# Altium project Cleanroom PSM.PrjPcb
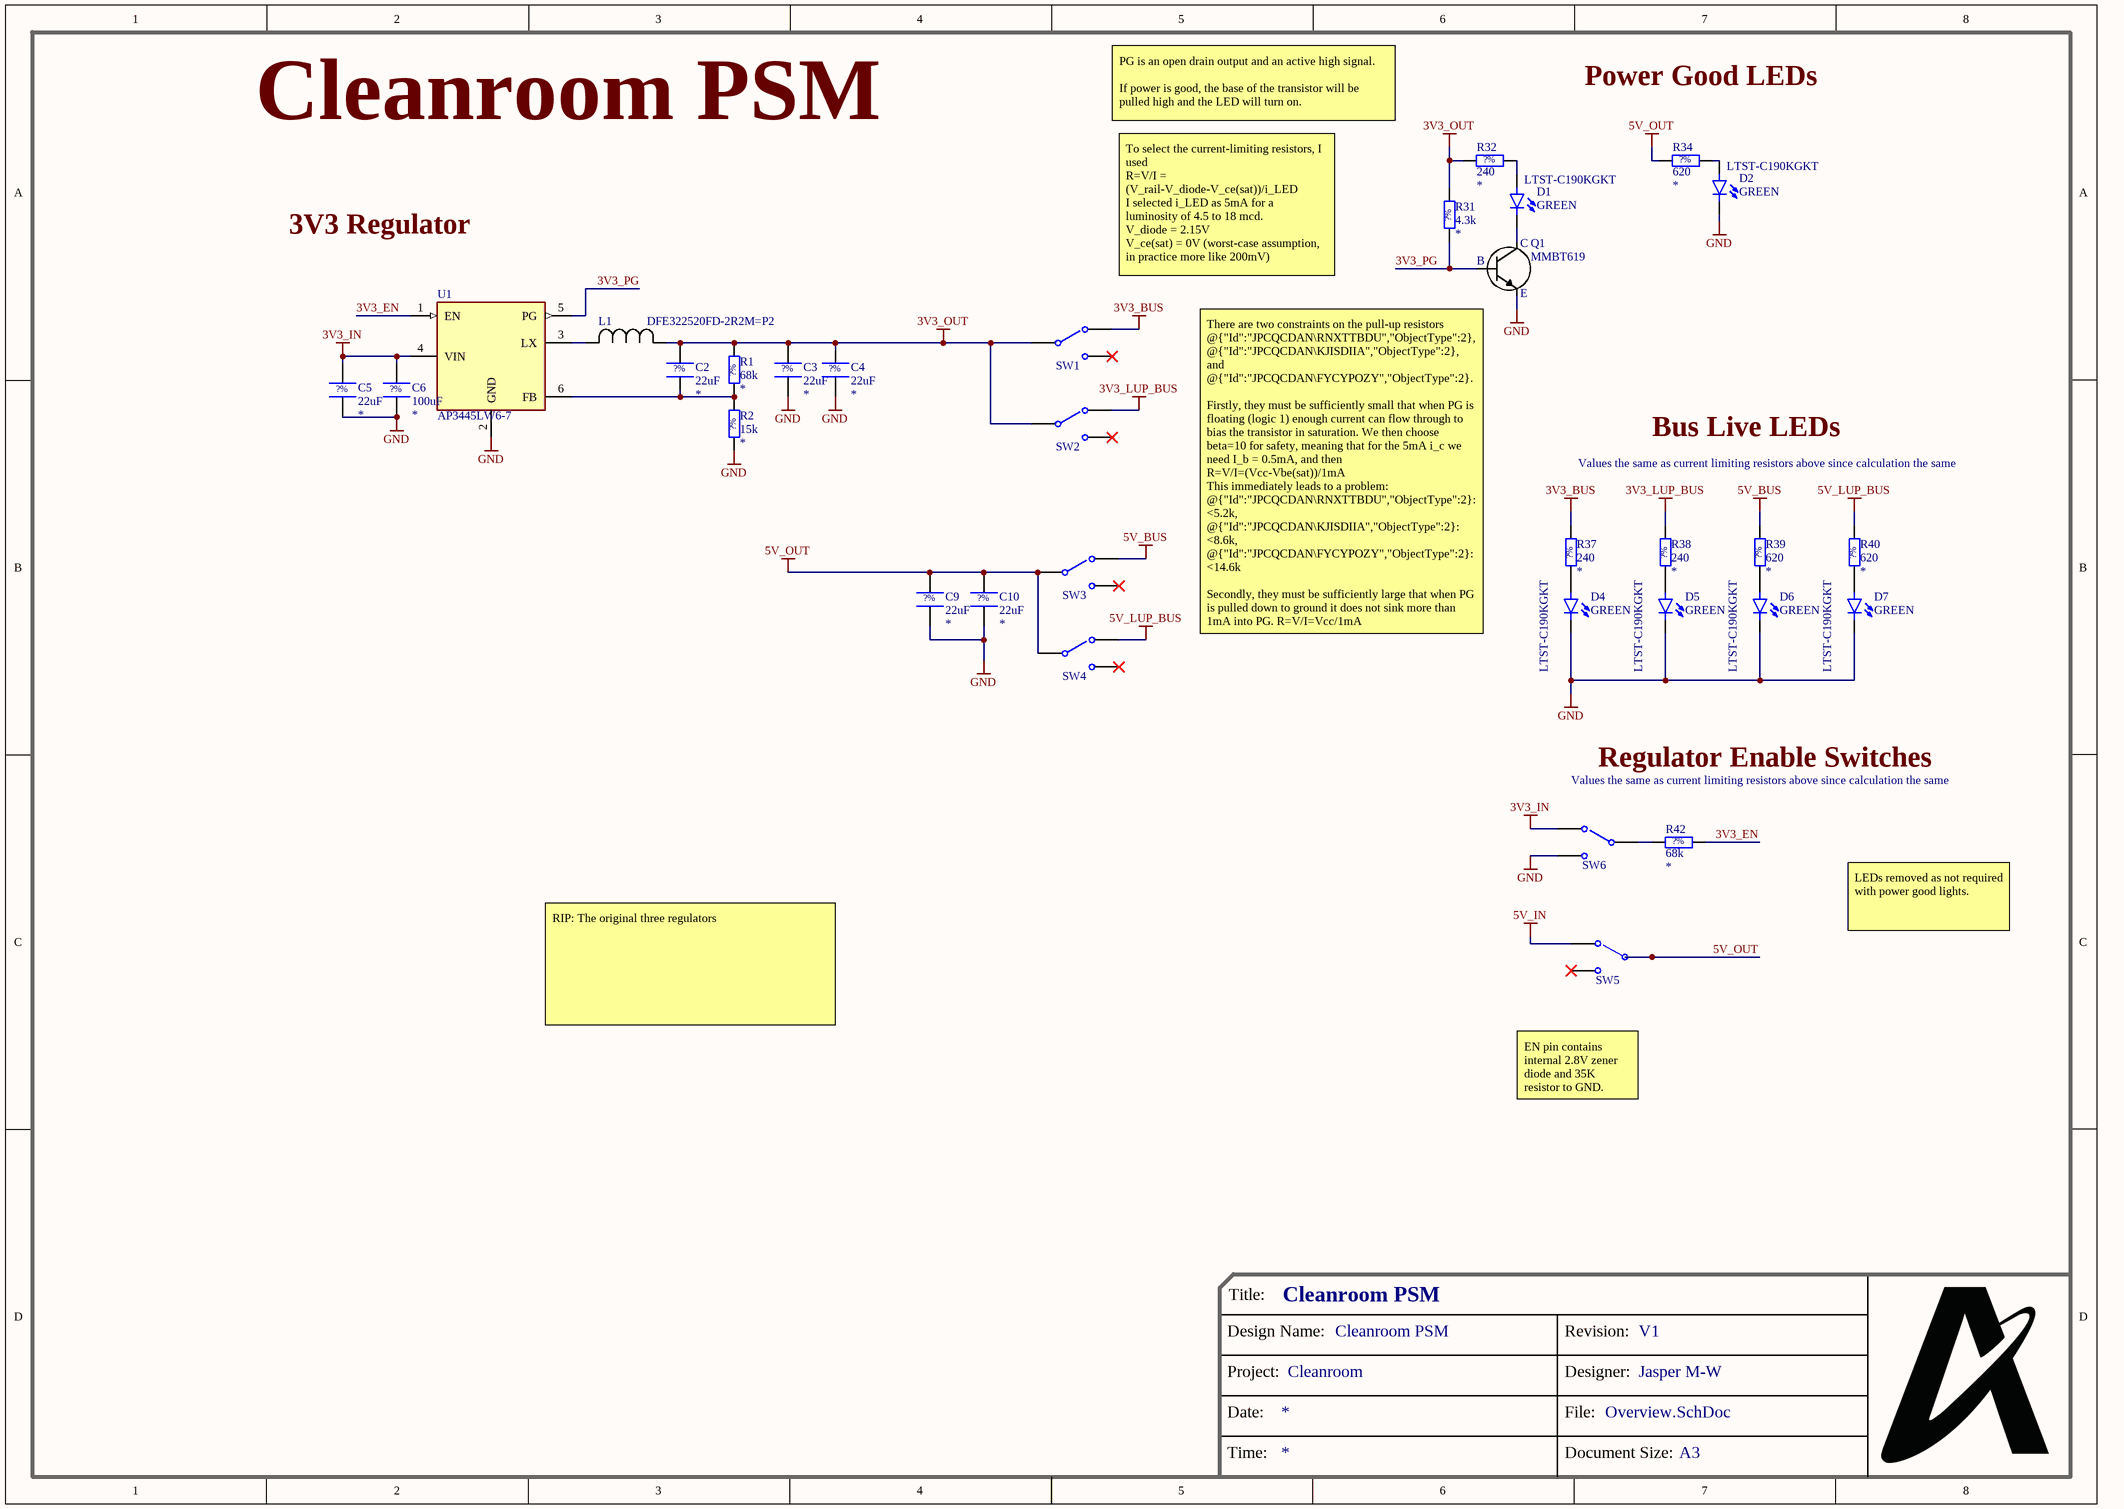
[diagram p0: Overview.SchDoc]
BoardRevision: V1; Designer: Jasper M-W; DesignName: Cleanroom PSM; Project: Cleanroom
2 sheets, 63 parts. Net scope: global (net labels, ports and power ports of the same name join across sheets).
Board file: Overview.PcbDoc
Sheets:
  Overview.SchDoc
  Interfaces.SchDoc

## Sheet Overview.SchDoc: Cleanroom PSM
size A3; PageSetup: Record=PageOptions|CenterHorizontal=True|CenterVertical=True|PrintScale=0.97|XCorrection=1.00|YCorrection=1.00|PrintKind=0|BorderSize=5000000|LeftOffset=0|BottomOffset=0|Orientation=2|PaperLength=1000|PaperWidth=1000|Scale=100|PaperSource=7|PrintQuality=-4|MediaType=1|DitherType=10|PaperKind=A4|PrintScaleMode=1; Revision: 1.1.0; SheetNumber: 1; SheetTotal: 2

### Parts
C2  22uF  [CAPACITOR_0805_2012M-70N]
C3  22uF  [CAPACITOR_0805_2012M-70N]
C4  22uF  [CAPACITOR_0805_2012M-70N]
C5  22uF  [CAPACITOR_0805_2012M-70N]
C6  100uF  [CAPACITOR_0805_2012M-70N]
C9  22uF  [CAPACITOR_0805_2012M-70N]
C10  22uF  [CAPACITOR_0805_2012M-70N]
D1  MF Part No.: LTST-C190KGKT  Colour: GREEN  [LED_0603_1608M_0.80mm]  (hidden comment: LTST-C190 Series)
D2  MF Part No.: LTST-C190KGKT  Colour: GREEN  [LED_0603_1608M_0.80mm]  (hidden comment: LTST-C190 Series)
D4  MF Part No.: LTST-C190KGKT  Colour: GREEN  [LED_0603_1608M_0.80mm]  (hidden comment: LTST-C190 Series)
D5  MF Part No.: LTST-C190KGKT  Colour: GREEN  [LED_0603_1608M_0.80mm]  (hidden comment: LTST-C190 Series)
D6  MF Part No.: LTST-C190KGKT  Colour: GREEN  [LED_0603_1608M_0.80mm]  (hidden comment: LTST-C190 Series)
D7  MF Part No.: LTST-C190KGKT  Colour: GREEN  [LED_0603_1608M_0.80mm]  (hidden comment: LTST-C190 Series)
L1  DFE322520FD-2R2M=P2  [IND_DFE3225_MUR]
Q1  MMBT619  [SOT23-3N-1.15mm]
R1  68k  [RESISTOR_0805_2012M-50N]
R2  15k  [RESISTOR_0805_2012M-50N]
R31  4.3k  [RESISTOR_0805_2012M-50N]
R32  240  [RESISTOR_0805_2012M-50N]
R34  620  [RESISTOR_0805_2012M-50N]
R37  240  [RESISTOR_0805_2012M-50N]
R38  240  [RESISTOR_0805_2012M-50N]
R39  620  [RESISTOR_0805_2012M-50N]
R40  620  [RESISTOR_0805_2012M-50N]
R42  68k  [RESISTOR_0805_2012M-50N]
SW1  ANT11SF1CQE  [ANT11SF1CQE]  (value not drawn)
SW2  ANT11SF1CQE  [ANT11SF1CQE]  (value not drawn)
SW3  ANT11SF1CQE  [ANT11SF1CQE]  (value not drawn)
SW4  ANT11SF1CQE  [ANT11SF1CQE]  (value not drawn)
SW5  ANT11SF1CQE  [ANT11SF1CQE]  (value not drawn)
SW6  ANT11SF1CQE  [ANT11SF1CQE]  (value not drawn)
U1  AP3445LW6-7  [SOT23-6N-1.4mm]

### Nets
3V3_BUS: R37.2 SW1.1
3V3_IN: C5.2 C6.2 SW5.1 SW6.1 U1.4(VIN)  [also labelled 5V_IN]
3V3_LUP_BUS: R38.2 SW2.1
3V3_OUT: C2.2 C3.2 C4.2 L1.1 R1.2 R31.2 R32.1 SW1.2 SW2.2
5V_BUS: R39.2 SW3.1
5V_LUP_BUS: R40.2 SW4.1
5V_OUT: C9.2 C10.2 R34.1 SW3.2 SW4.2 SW5.2
GND: C3.1 C4.1 C5.1 C6.1 C9.1 C10.1 D2.C D4.C D5.C D6.C D7.C Q1.2(E) R2.1 SW6.3 U1.2(GND)
3V3_EN: R42.2 U1.1(EN)
3V3_PG: Q1.1(B) R31.1 U1.5(PG)
NetC2_1: C2.1 R1.1 R2.2 U1.6(FB)
NetD1_A: D1.A R32.2
NetD1_C: D1.C Q1.3(C)
NetD2_A: D2.A R34.2
NetD4_A: D4.A R37.1
NetD5_A: D5.A R38.1
NetD6_A: D6.A R39.1
NetD7_A: D7.A R40.1
NetL1_2: L1.2 U1.3(LX)
NetR42_1: R42.1 SW6.2

Not connected (* = marked no-connect by the designer): SW1 3*; SW2 3*; SW3 3*; SW4 3*; SW5 3*

### Notes on the sheet
- Power Good LEDs
- Cleanroom PSM
- PG is an open drain output and an active high signal.
  If power is good, the base of the transistor will be pulled high and the LED will turn on.
- 3V3 Regulator
- To select the current-limiting resistors, I used
  R=V/I = (V_rail-V_diode-V_ce(sat))/i_LED
  I selected i_LED as 5mA for a luminosity of 4.5 to 18 mcd.
  V_diode = 2.15V
  V_ce(sat) = 0V (worst-case assumption, in practice more like 200mV)
- Bus Live LEDs
- Values the same as current limiting resistors above since calculation the same
- (near Q1) There are two constraints on the pull-up resistors @{"Id":"JPCQCDAN\RNXTTBDU","ObjectType":2}, @{"Id":"JPCQCDAN\KJISDIIA","ObjectType":2}, and @{"Id":"JPCQCDAN\FYCYPOZY","ObjectType":2}.
  Firstly, they must be sufficiently small that when PG is floating (logic 1) enough current can flow through to bias the transistor in saturation. We then choose beta=10 for safety, meaning that for the 5mA i_c we need I_b = 0.5mA, and then R=V/I=(Vcc-Vbe(sat))/1mA
  This immediately leads to a problem:
  @{"Id":"JPCQCDAN\RNXTTBDU","ObjectType":2}: <5.2k, @{"Id":"JPCQCDAN\KJISDIIA","ObjectType":2}: <8.6k, @{"Id":"JPCQCDAN\FYCYPOZY","ObjectType":2}: <14.6k
  Secondly, they must be sufficiently large that when PG is pulled down to ground it does not sink more than 1mA into PG. R=V/I=Vcc/1mA
  @{"Id":"JPCQCDAN\RNXTTBDU","ObjectType":2}: >3.3k, @{"Id":"JPCQCDAN\KJISDIIA","ObjectType":2}: >5k, @{"Id":"JPCQCDAN\FYCYPOZY","ObjectType":2}: >8k
  Taking the mean of each of these ranges and rounding to the nearest E24,
  @{"Id":"JPCQCDAN\RNXTTBDU","ObjectType":2}: 4.3k, @{"Id":"JPCQCDAN\KJISDIIA","ObjectType":2}: 6.8k, @{"Id":"JPCQCDAN\FYCYPOZY","ObjectType":2}: 11k
- Regulator Enable Switches
- LEDs removed as not required with power good lights.
- RIP: The original three regulators
- EN pin contains internal 2.8V zener diode and 35K resistor to GND.
- Title:
- Design Name:
- Project:
- Revision:
- Designer:
- Date:
- Time:
- File:
- Document Size:
- A3

### Library data of the parts
C2-C6 C9 C10 = Generic Capacitor: Passive - Capacitor, Generic; Tolerance: ?%; MF Part No.: *
  C2-C5 C9 C10: Value: 22uF
  C6: Value: 100uF
D1 D2 D4-D7 = LTST-C190 Series: Diode - LED, 0603; APSS Standard Part: APSS Standard; Temp Range: -30°C ~ 85°C; Rated Voltage: 5V Reverse; Package: 0603; Supplier 1: Digikey
L1 = DFE322520FD-2R2M=P2: Description; Manufacturer_Name: Murata; Type: Fixed Inductors; Copyright: Copyright (C) 2025 Ultra Librarian. All rights reserved.; Manufacturer_Part_Number: DFE322520FD-2R2M=P2
Q1 = MMBT619: Transistor - BJT NPN MMBT619; APSS Standard Part: APSS Standard; Temp Range: -55°C ~ 150°C (TJ); Rated Voltage: 50 Vce; Power: 350mW; MF Part No.: MMBT619; Package: SOT-23-3; Supplier 1: Digikey; Supplier 1 Part No.: 4786-MMBT619CT-ND
R1 R2 R31 R32 R34 R37-R40 R42 = Generic Resistor: Passive - Resistor, Generic; Tolerance: ?%; MF Part No.: *
  R1 R42: Value: 68k
  R2: Value: 15k
  R31: Value: 4.3k
  R32 R37 R38: Value: 240
  R34 R39 R40: Value: 620
SW1-SW6 = ANT11SF1CQE: Switch - Toggle, SPDT, 5A @ 28VDC; Temp Range: -40°C ~ 85°C (TA); MF Part No.: ANT11SF1CQE; Package: -; Supplier 1: Digikey; Supplier 1 Part No.: 2449-ANT11SF1CQE-ND; Rated Current: 5A; Rated Voltage: 28 VDC; Circuit: SPDT
U1 = AP3445LW6-7: IC - Regulator, Buck, 2A, 2.7V to 5.5V In, 0.6V to Vin Out, SOT23-6; APSS Standard Part: APSS Standard; Temp Range: -40°C ~ 85°C (TA); MF Part No.: AP3445LW6-7; Package: SOT-23-5; Supplier 1: Digikey; Supplier 1 Part No.: AP3445LW6-7DICT-ND; Rated Voltage: 5.5V

## Sheet Interfaces.SchDoc: PSM Interfaces
size A4; Author: SCH Originator; CompanyName: Invenco Group Ltd; DrawnBy: PCB Originator; Address1: 7-11 Kawana Street; Address2: Northcote; Address3: Auckland 0627; Address4: New Zealand; Revision: Use ProjectOptions->Parameters->ProjectRevision; SheetNumber: 2; SheetTotal: 2; PageSetup: Record=PageOptions|CenterHorizontal=True|CenterVertical=True|PrintScale=0.97|XCorrection=1.00|YCorrection=1.00|PrintKind=0|BorderSize=5000000|LeftOffset=0|BottomOffset=0|Orientation=2|PaperLength=1000|PaperWidth=1000|Scale=100|PaperSource=7|PrintQuality=-4|MediaType=1|DitherType=10|PaperKind=A4|PrintScaleMode=1; ContactDetails: www.invenco.com; Designer: Jasper M-W; ProjectName: Cleanroom PSM.PrjPcb
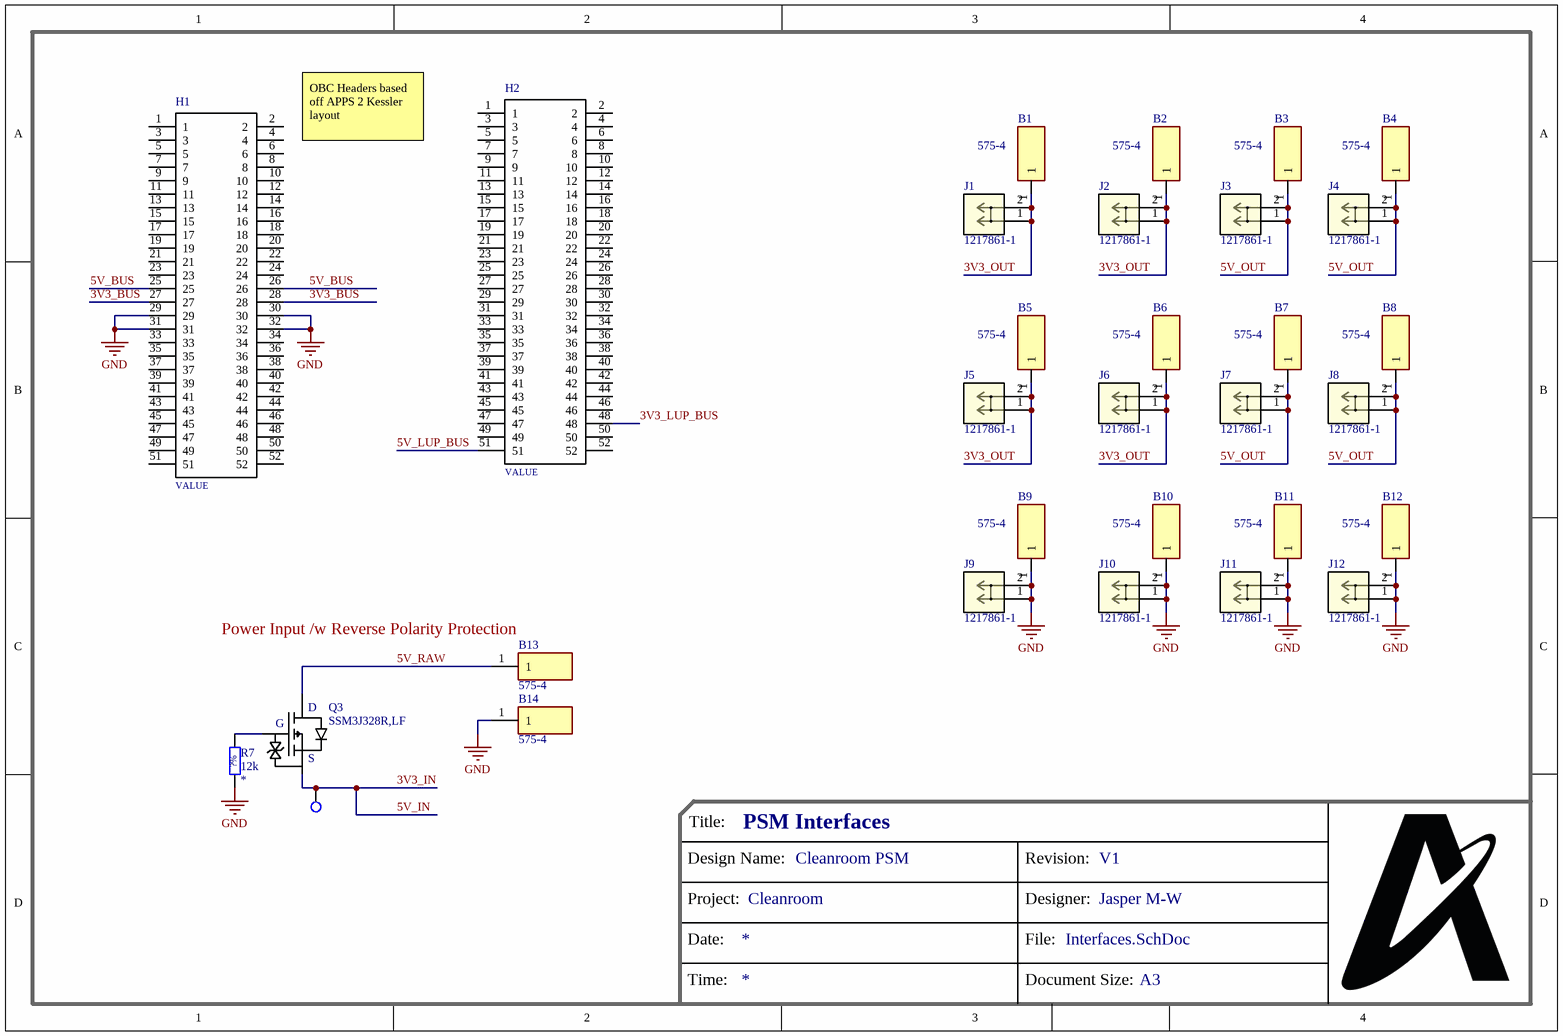
[diagram p1: Interfaces.SchDoc]

### Parts
B1  575-4  [5754]
B2  575-4  [5754]
B3  575-4  [5754]
B4  575-4  [5754]
B5  575-4  [5754]
B6  575-4  [5754]
B7  575-4  [5754]
B8  575-4  [5754]
B9  575-4  [5754]
B10  575-4  [5754]
B11  575-4  [5754]
B12  575-4  [5754]
B13  575-4  [5754]
B14  575-4  [5754]
H1  ESQ-126-14-G-D  [*SAMTEC_ESQ-126-14-G-D]  (value not drawn)
H2  ESQ-126-14-G-D  [*SAMTEC_ESQ-126-14-G-D]  (value not drawn)
J1  1217861-1  [CONN_1217861-1_TEC]
J2  1217861-1  [CONN_1217861-1_TEC]
J3  1217861-1  [CONN_1217861-1_TEC]
J4  1217861-1  [CONN_1217861-1_TEC]
J5  1217861-1  [CONN_1217861-1_TEC]
J6  1217861-1  [CONN_1217861-1_TEC]
J7  1217861-1  [CONN_1217861-1_TEC]
J8  1217861-1  [CONN_1217861-1_TEC]
J9  1217861-1  [CONN_1217861-1_TEC]
J10  1217861-1  [CONN_1217861-1_TEC]
J11  1217861-1  [CONN_1217861-1_TEC]
J12  1217861-1  [CONN_1217861-1_TEC]
Q3  SSM3J328R,LF  [SOT23F-3-0.8mm]
R7  12k  [RESISTOR_0805_2012M-50N]
T1  Test Pad  [Test Pad]  (value not drawn)  (no BOM)

### Nets
3V3_BUS: H1.27 H1.28
3V3_IN: Q3.2(S) T1.1  [also labelled 5V_IN]
3V3_LUP_BUS: H2.48
3V3_OUT: B1.1 B2.1 B5.1 B6.1 J1.1 J1.2 J2.1 J2.2 J5.1 J5.2 J6.1 J6.2
5V_BUS: H1.25 H1.26
5V_LUP_BUS: H2.51
5V_OUT: B3.1 B4.1 B7.1 B8.1 J3.1 J3.2 J4.1 J4.2 J7.1 J7.2 J8.1 J8.2
GND: B9.1 B10.1 B11.1 B12.1 B14.1 H1.29 H1.30 H1.31 H1.32 J9.1 J9.2 J10.1 J10.2 J11.1 J11.2 J12.1 J12.2 R7.1
5V_RAW: B13.1 Q3.3(D)
NetQ3_1: Q3.1(G) R7.2

Not connected (* = marked no-connect by the designer): H1 1 2 3 4 5 6 7 8 9 10 11 12 13 14 15 16 17 18 19 20 21 22 23 24 33 34 35 36 37 38 39 40 41 42 43 44 45 46 47 48 49 50 51 52; H2 1 2 3 4 5 6 7 8 9 10 11 12 13 14 15 16 17 18 19 20 21 22 23 24 25 26 27 28 29 30 31 32 33 34 35 36 37 38 39 40 41 42 43 44 45 46 47 49 50 52

### Notes on the sheet
- (near H1) OBC Headers based off APPS 2 Kessler layout
- (near B13) Power Input /w Reverse Polarity Protection
- Title:
- Design Name:
- Project:
- Revision:
- Designer:
- Date:
- Time:
- File:
- Document Size:
- A3
- (in symbol ESQ-126-14-G-D) VALUE

### Library data of the parts
B1-B14 = 575-4: Test Plugs & Test Jacks NON-INSUL JACK .218" BRASS NICKEL PLTD; Manufacturer_Name: Keystone Electronics; Geometry.Height: 2.49mm; Mouser Part Number: 534-575-4; Mouser Price/Stock: https://www.mouser.co.uk/ProductDetail/Keystone-Electronics/575-4?qs=w4ABFRoM%2FL8pPaUzIDyX8Q%3D%3D; Manufacturer_Part_Number: 575-4; Datasheet Link: https://www.keyelco.com/product.cfm/product_id/2379
H1 H2 = ESQ-126-14-G-D: S1PN: SAM11114-ND; MF: Samtec Inc.; MCR: 5.7A; MVP: Y; MVR: 550VAC; TEMP: -55°C ~ 125°C; MFPN: ESQ-126-14-G-D; S1L: https://www.digikey.co.nz/product-detail/en/samtec-inc/ESQ-126-14-G-D/SAM11114-ND/6695078
J1-J12 = 1217861-1: 250 FASTON,PCB TAB,TCBR; Manufacturer_Name: TE Connectivity; Copyright: Copyright (C) 2025 Ultra Librarian. All rights reserved.; Manufacturer_Part_Number: 1217861-1; RefDes: RefDes; Type: Type
Q3 = SSM3J328R,LF: Transistor - MOSFET, P-Channel SSM3J328R,LF; APSS Standard Part: APSS Standard; Temp Range: 0°C ~ 150°C (TJ); Rated Voltage: 20 Vds; Power: 1W; MF Part No.: SSM3J328R,LF; Package: SOT23-3; Supplier 1: Digikey; Supplier 1 Part No.: SSM3J328RLFCT-ND
R7 = Generic Resistor: as R1 on sheet Overview; MF Part No.: *; Value: 12k

## Nets that join several sheets
3V3_BUS: Overview (R37.2 SW1.1), Interfaces (H1.27 H1.28)
3V3_IN: Overview (5 pins), Interfaces (Q3.2 T1.1)
3V3_LUP_BUS: Overview (R38.2 SW2.1), Interfaces (H2.48)
3V3_OUT: Overview (9 pins), Interfaces (12 pins)
5V_BUS: Overview (R39.2 SW3.1), Interfaces (H1.25 H1.26)
5V_LUP_BUS: Overview (R40.2 SW4.1), Interfaces (H2.51)
5V_OUT: Overview (6 pins), Interfaces (12 pins)
GND: Overview (15 pins), Interfaces (18 pins)